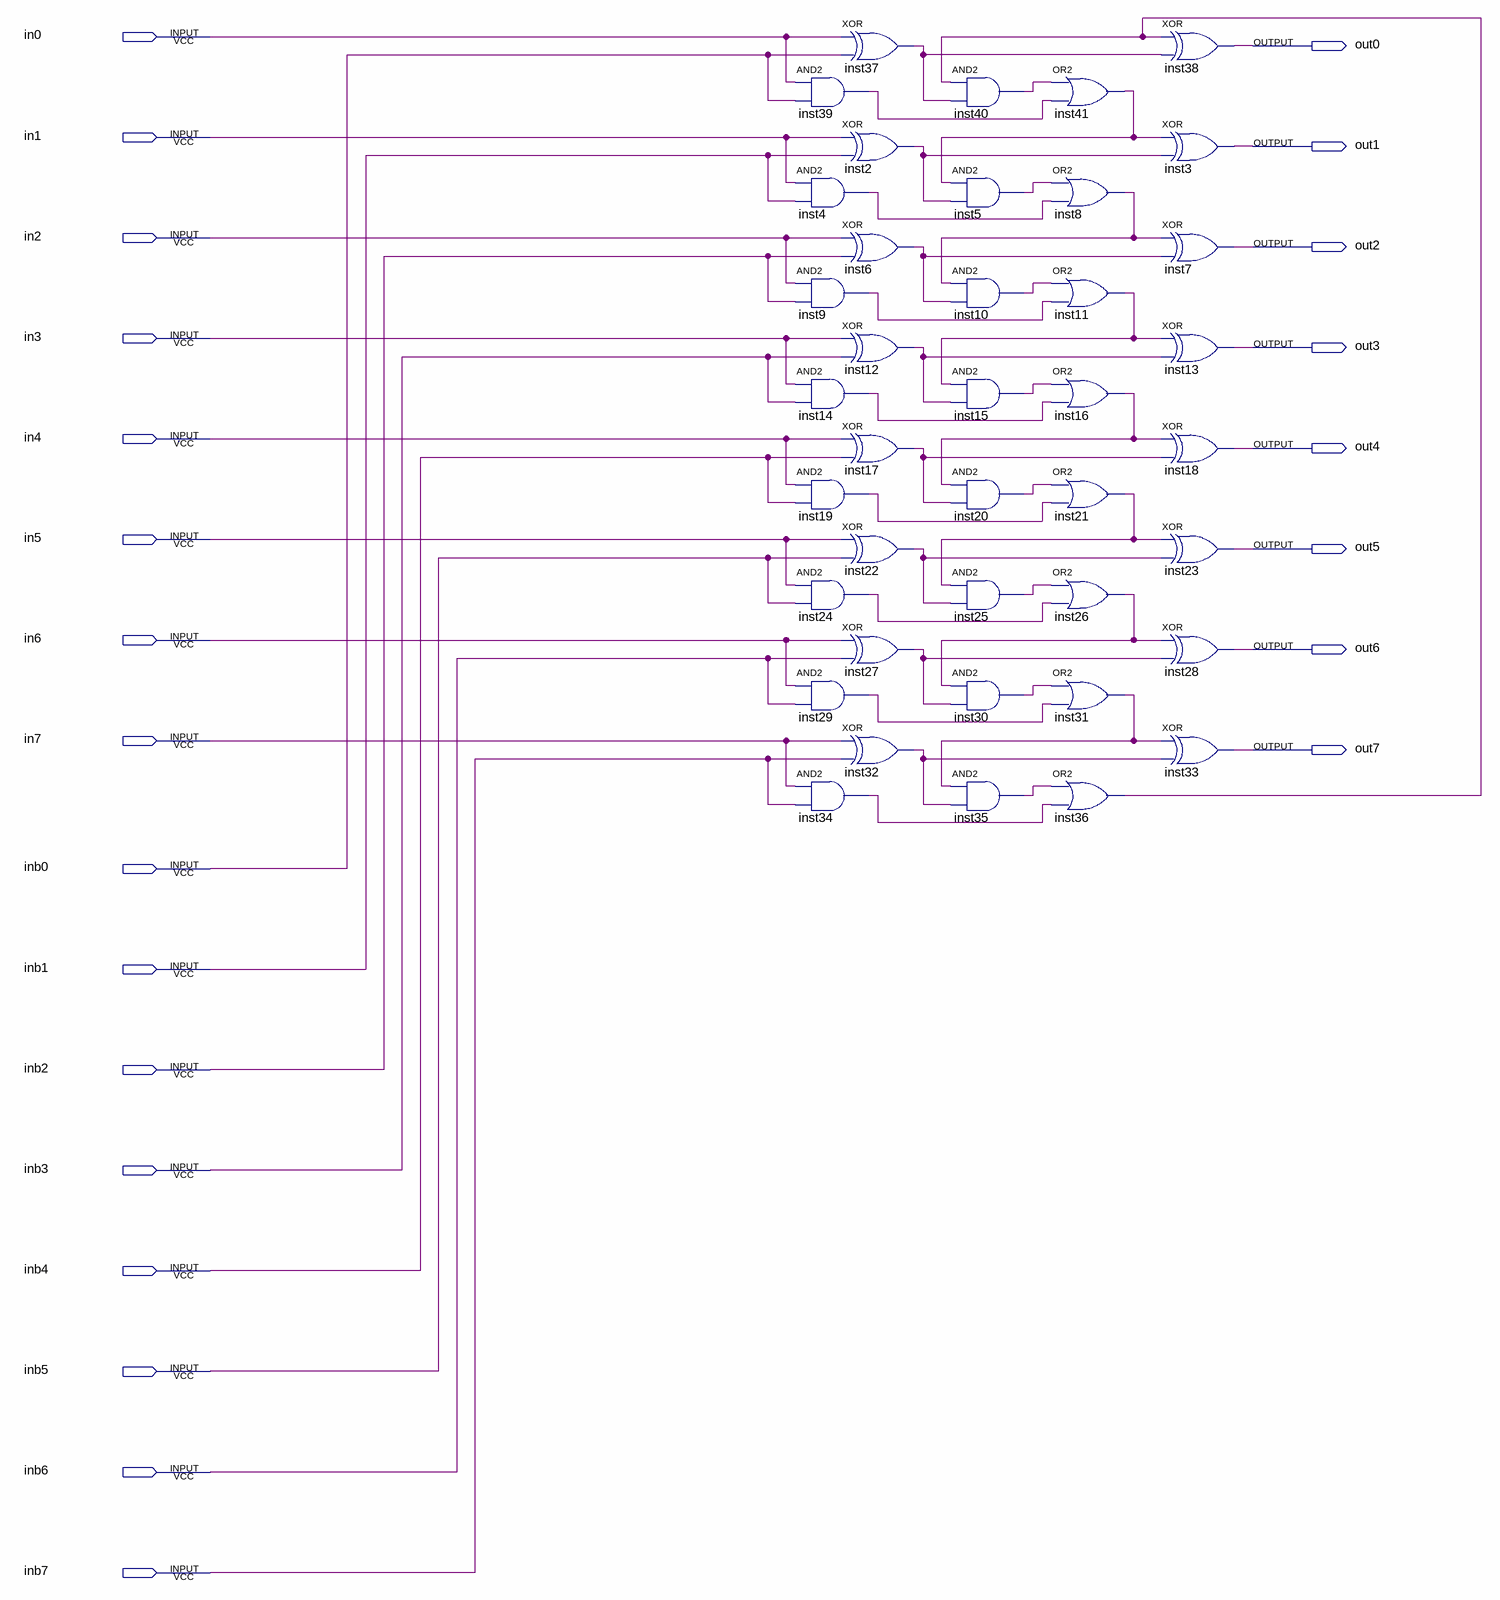
[diagram p0: schematic sheet]
// Quartus schematic adder8.bdf as structural Verilog: 40 symbols, 24 pins
module adder8 (
  input  in0,
  input  in1,
  input  in2,
  input  in3,
  input  in4,
  input  in5,
  input  in6,
  input  in7,
  input  inb0,
  input  inb1,
  input  inb2,
  input  inb3,
  input  inb4,
  input  inb5,
  input  inb6,
  input  inb7,
  output out0,
  output out1,
  output out2,
  output out3,
  output out4,
  output out5,
  output out6,
  output out7
);

  wire inst2_out, inst4_out, inst5_out, inst6_out, inst8_out, inst9_out, inst10_out, inst11_out, inst12_out,
       inst14_out, inst15_out, inst16_out, inst17_out, inst19_out, inst20_out, inst21_out, inst22_out,
       inst24_out, inst25_out, inst26_out, inst27_out, inst29_out, inst30_out, inst31_out, inst32_out,
       inst34_out, inst35_out, inst36_out, inst37_out, inst39_out, inst40_out, inst41_out;

  xor inst37 (inst37_out, in0, inb0);
  and inst39 (inst39_out, in0, inb0);
  xor inst2 (inst2_out, in1, inb1);
  and inst4 (inst4_out, in1, inb1);
  xor inst6 (inst6_out, in2, inb2);
  and inst9 (inst9_out, in2, inb2);
  xor inst12 (inst12_out, in3, inb3);
  and inst14 (inst14_out, in3, inb3);
  xor inst17 (inst17_out, in4, inb4);
  and inst19 (inst19_out, in4, inb4);
  xor inst22 (inst22_out, in5, inb5);
  and inst24 (inst24_out, in5, inb5);
  xor inst27 (inst27_out, in6, inb6);
  and inst29 (inst29_out, in6, inb6);
  xor inst32 (inst32_out, in7, inb7);
  and inst34 (inst34_out, in7, inb7);
  and inst40 (inst40_out, inst36_out, inst37_out);
  and inst5 (inst5_out, inst41_out, inst2_out);
  and inst10 (inst10_out, inst8_out, inst6_out);
  and inst15 (inst15_out, inst11_out, inst12_out);
  and inst20 (inst20_out, inst16_out, inst17_out);
  and inst25 (inst25_out, inst21_out, inst22_out);
  and inst30 (inst30_out, inst26_out, inst27_out);
  and inst35 (inst35_out, inst31_out, inst32_out);
  or inst41 (inst41_out, inst40_out, inst39_out);
  or inst8 (inst8_out, inst5_out, inst4_out);
  or inst11 (inst11_out, inst10_out, inst9_out);
  or inst16 (inst16_out, inst15_out, inst14_out);
  or inst21 (inst21_out, inst20_out, inst19_out);
  or inst26 (inst26_out, inst25_out, inst24_out);
  or inst31 (inst31_out, inst30_out, inst29_out);
  or inst36 (inst36_out, inst35_out, inst34_out);
  xor inst38 (out0, inst36_out, inst37_out);
  xor inst3 (out1, inst41_out, inst2_out);
  xor inst7 (out2, inst8_out, inst6_out);
  xor inst13 (out3, inst11_out, inst12_out);
  xor inst18 (out4, inst16_out, inst17_out);
  xor inst23 (out5, inst21_out, inst22_out);
  xor inst28 (out6, inst26_out, inst27_out);
  xor inst33 (out7, inst31_out, inst32_out);
endmodule
